# Altium schematic sheet RS323.SchDoc
size A4; SheetNumber: 3; SheetTotal: 9
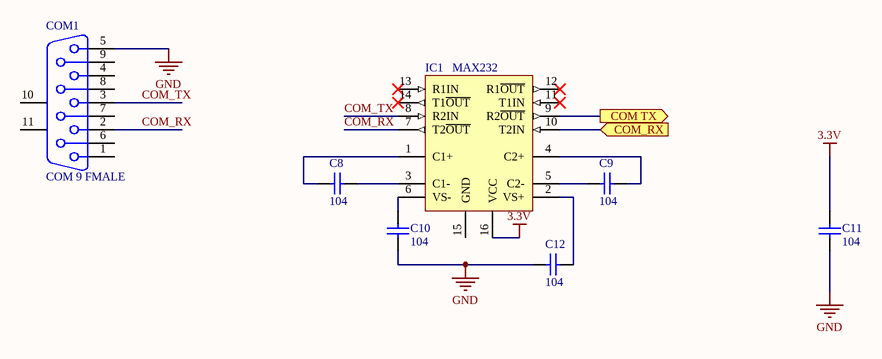
[diagram p0: RS323.SchDoc]

## Parts
C8  104  [tu 0603]
C9  104  [tu 0603]
C10  104  [tu 0603]
C11  104  [tu 0603]
C12  104  [tu 0603]
COM1  COM 9 FMALE  [DSB 9-F]
IC1  MAX232  [sop 16]

## Ports
COM TX (out), COM_RX (in)

## Nets
3.3V: C11.1 IC1.16(VCC)
GND: C10.1 C11.2 C12.1 COM1.5
COM TX: IC1.9(R2~{OUT}) ; port COM TX
COM_RX: COM1.2 IC1.7(T2~{OUT})
COM_RX: IC1.10(T2IN) ; port COM_RX  [a separate net that carries the same name]
COM_TX: COM1.3 IC1.8(R2IN)
NetC8_1: C8.1 IC1.1(C1+)
NetC8_2: C8.2 IC1.3(C1-)
NetC9_1: C9.1 IC1.5(C2-)
NetC9_2: C9.2 IC1.4(C2+)
NetC10_2: C10.2 IC1.6(VS-)
NetC12_2: C12.2 IC1.2(VS+)

Not connected (* = marked no-connect by the designer): COM1 1 4 6 7 8 9 10(MH1) 11(MH2); IC1 11(T1IN)* 12(R1~{OUT})* 13(R1IN)* 14(T1~{OUT})* 15(GND)

## Library data of the parts
C8-C12 = Tu 0603 104 50V 10%: Dán; Don_Vi: Con; So_Chan: 2; Ten_Linh_Kien: Tụ 0603 104-100nF 10% 50V; Ma_Hang: MH004568; Chung_Loai: Dán; Kieu_Chan: *
COM1 = DSB9F: COM 9; PackageDocument: O; Positions: 9; Gender: Receptacle; Value: COM 9; Published: 15-Jun-2001; LatestRevisionDate: 17-Jul-2002; LatestRevisionNote: Re-released for DXP Platform.; DatasheetDocument: 1-Sep-1999; PackageReference: 788750; Publisher: Altium Limited; Orientation: Right Angle
IC1 = MAX232: Dual EIA-232 Driver/Receiver; Value: MAX232